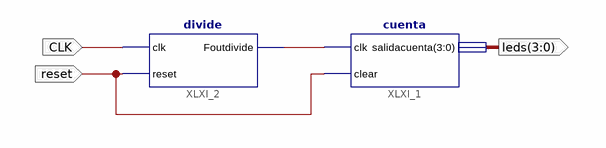
[diagram p0: schematic sheet 1]
// Xilinx ISE schematic SuperiorContador.sch (spartan6) as structural Verilog: 2 symbols, 3 ports
module SuperiorContador (
  input  CLK,
  input  reset,
  output [3:0] leds
);

  wire XLXN_4;

  cuenta XLXI_1 (.clk(XLXN_4), .clear(reset), .salidacuenta(leds));
  divide XLXI_2 (.clk(CLK), .reset(reset), .Foutdivide(XLXN_4));
endmodule
